# EAGLE design Proyecto (EAGLE 9.1.3)
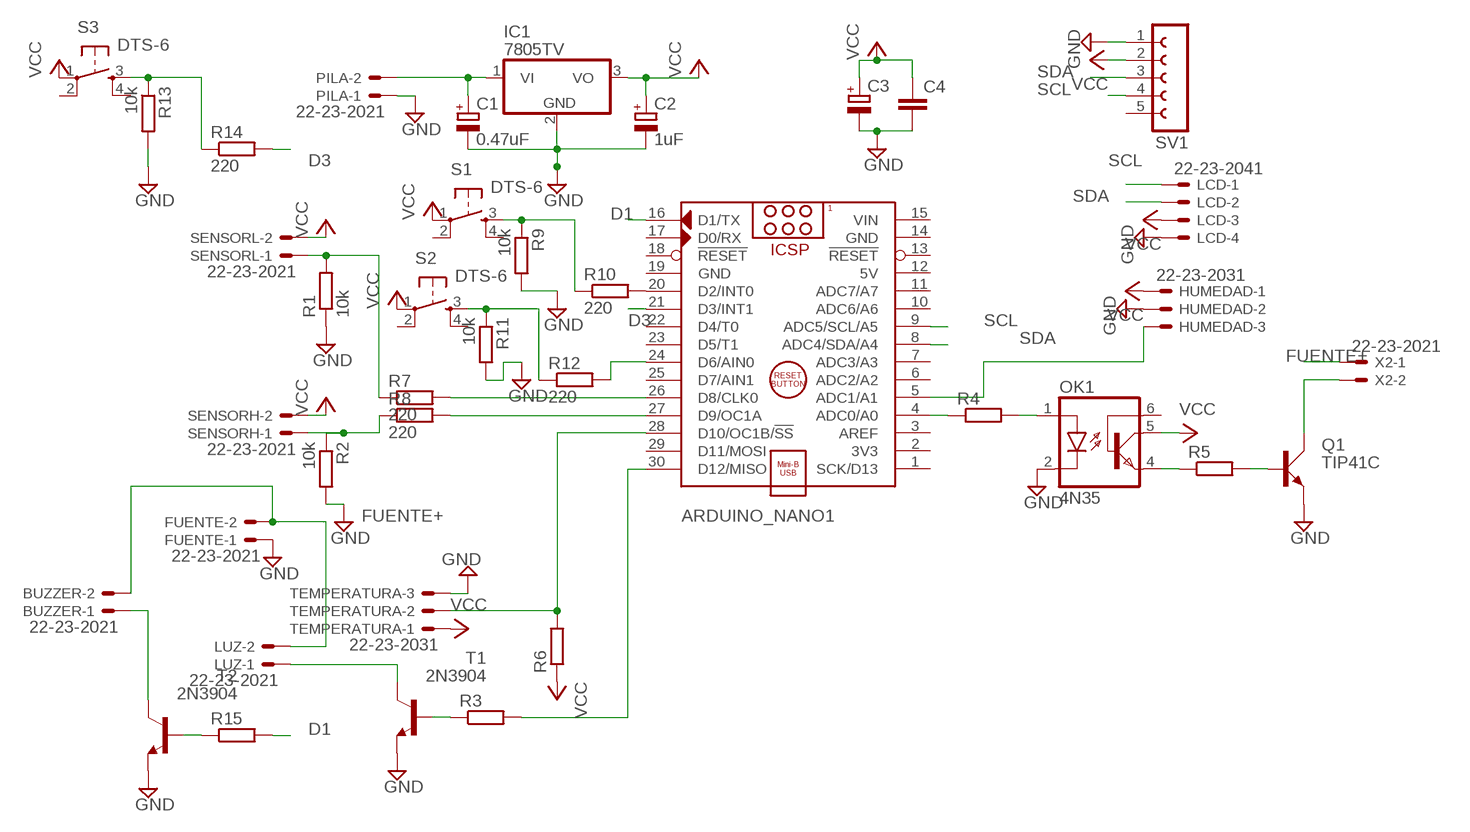
[diagram p0: schematic, sheet 1]

## Parts
ARDUINO_NANO1  ARDUINO_NANO  [ARDUINO_NANO]
BUZZER  22-23-2021  [22-23-2021]
C1  0.47uF  CPOL-EUE1.8-4  [E1,8-4]
C2  1uF  CPOL-EUE1.8-4  [E1,8-4]
C3  CPOL-EUE3.5-10  [E3,5-10]
C4  C-EU025-040X050  [C025-040X050]
FUENTE  22-23-2021  [22-23-2021]
HUMEDAD  22-23-2031  [22-23-2031]
IC1  7805TV  [TO220V]
LCD  22-23-2041  [22-23-2041]
LUZ  22-23-2021  [22-23-2021]
OK1  4N35  [DIL06]
PILA  22-23-2021  [22-23-2021]
Q1  TIP41C  [TO220AV]
R1  10k  R-EU_0207/10  [0207/10]
R2  10k  R-EU_0207/10  [0207/10]
R3  R-EU_0207/10  [0207/10]
R4  R-EU_0207/10  [0207/10]
R5  R-EU_0207/10  [0207/10]
R6  R-EU_0207/10  [0207/10]
R7  220  R-EU_0207/10  [0207/10]
R8  220  R-EU_0207/10  [0207/10]
R9  10k  R-EU_0207/10  [0207/10]
R10  220  R-EU_0207/10  [0207/10]
R11  10k  R-EU_0207/10  [0207/10]
R12  220  R-EU_0207/10  [0207/10]
R13  10k  R-EU_0207/10  [0207/10]
R14  220  R-EU_0207/10  [0207/10]
R15  R-EU_0207/10  [0207/10]
S1  DTS-6  [DTS-6]
S2  DTS-6  [DTS-6]
S3  DTS-6  [DTS-6]
SENSORH  22-23-2021  [22-23-2021]
SENSORL  22-23-2021  [22-23-2021]
SV1  FE05-1  [FE05-1]
T1  2N3904  [TO92]
T2  2N3904  [TO92]
TEMPERATURA  22-23-2031  [22-23-2031]
X2  22-23-2021  [22-23-2021]

## Nets
D1: ARDUINO_NANO1.16(D1/TX) R15.2
D3: ARDUINO_NANO1.21(D3/INT1) R14.2
FUENTE+: BUZZER.2 FUENTE.2 LUZ.2 X2.1
GND: C1.- C2.- C3.- C4.2 FUENTE.1 HUMEDAD.2 IC1.2(GND) LCD.4 OK1.2(C) PILA.1 Q1.E R1.1 R2.2 R9.2 R11.2 R13.2 SV1.1 T1.3(E) T2.3(E) TEMPERATURA.3
N$1: ARDUINO_NANO1.28(D10/OC1B/!SS) R6.2 TEMPERATURA.2
N$2: R1.2 R7.1 SENSORL.1
N$3: R2.1 R8.1 SENSORH.1
N$4: LUZ.1 T1.1(C)
N$5: R3.1 T1.2(B)
N$6: ARDUINO_NANO1.30(D12/MISO) R3.2
N$7: Q1.B R5.2
N$8: OK1.4(EMI) R5.1
N$9: Q1.C X2.2
N$10: OK1.1(A) R4.2
N$11: ARDUINO_NANO1.4(ADC0/A0) R4.1
N$12: ARDUINO_NANO1.27(D9/OC1A) R8.2
N$13: ARDUINO_NANO1.26(D8/CLK0) R7.2
N$14: C1.+ IC1.1(VI) PILA.2
N$15: ARDUINO_NANO1.5(ADC1/A1) HUMEDAD.3
N$16: R9.1 R10.1 S1.3
N$17: ARDUINO_NANO1.20(D2/INT0) R10.2
N$18: R11.1 R12.1 S2.3
N$19: ARDUINO_NANO1.24(D6/AIN0) R12.2
N$20: R13.1 R14.1 S3.3
N$21: BUZZER.1 T2.1(C)
N$22: R15.1 T2.2(B)
SCL: ARDUINO_NANO1.9(ADC5/SCL/A5) LCD.1 SV1.4
SDA: ARDUINO_NANO1.8(ADC4/SDA/A4) LCD.2 SV1.3
VCC: C2.+ C3.+ C4.1 HUMEDAD.1 IC1.3(VO) LCD.3 OK1.5(COL) R6.1 S1.1 S2.1 S3.1 SENSORH.2 SENSORL.2 SV1.2 TEMPERATURA.1
Unconnected: ARDUINO_NANO1.1(SCK/D13) ARDUINO_NANO1.2(3V3) ARDUINO_NANO1.3(AREF) ARDUINO_NANO1.6(ADC2/A2) ARDUINO_NANO1.7(ADC3/A3) ARDUINO_NANO1.10(ADC6/A6) ARDUINO_NANO1.11(ADC7/A7) ARDUINO_NANO1.13(!RESET) ARDUINO_NANO1.17(D0/RX) ARDUINO_NANO1.18(!RESET) ARDUINO_NANO1.22(D4/T0) ARDUINO_NANO1.23(D5/T1) ARDUINO_NANO1.25(D7/AIN1) ARDUINO_NANO1.29(D11/MOSI) OK1.6(BAS) S1.2 S1.4 S2.2 S2.4 S3.2 S3.4 SV1.5

## Power pins joined to a net without a drawn wire
5V: ARDUINO_NANO1.12(5V)
GND: ARDUINO_NANO1.14(GND) ARDUINO_NANO1.19(GND)
VIN: ARDUINO_NANO1.15(VIN)

## Library data of the parts
ARDUINO_NANO1 = ArduinoNanoV30:ARDUINO_NANO: Arduino Nano V3.0 Module Overview: The Arduino Nano is a small, complete, and breadboard-friendly board based on the ATmega328 (Arduino Nano 3.x) or ATmega168 (Arduino Nano 2.x). It has more or less the same functionality of the Arduino Duemilanove, but in a different package. It lacks only a DC power jack, and works with a Mini-B USB cable instead of a standard one. The Nano was designed and is being produced by Gravitech <http://www.gravitech.us/arna30wiatp.html>. General specifications: Item Value Microcontroller Atmel ATmega168 or ATmega328 Operating Voltage (logic level) 5 V Input Voltage (recommended) 7-12 V Input Voltage (limits) 6-20 V Digital I/O Pins 14 (of which 6 provide PWM output) Analog Input Pins 8 DC Current per I/O Pin 40 mA Flash Memory 16 KB (ATmega168) or 32 KB (ATmega328) of which 2 KB used by bootloader SRAM 1 KB (ATmega168) or 2 KB (ATmega328) EEPROM 512 bytes (ATmega168) or 1 KB (ATmega328) Clock Speed 16 MHz Dimensions (Inches) 0.73" x 1.70" Dimensions (mm) 18mm x 45mm Overall height About 9 mm (not including pins) Weigth 5 g Power: The Arduino Nano can be powered via the Mini-B USB connection, 6-20V unregulated external power supply (pin 30), or 5V regulated external power supply (pin 27). The power source is automatically selected to the highest voltage source. Memory: The ATmega168 has 16 KB of flash memory for storing code (of which 2 KB is used for the bootloader); the ATmega328 has 32 KB, (also with 2 KB used for the bootloader). The ATmega168 has 1 KB of SRAM and 512 bytes of EEPROM (which can be read and written with the EEPROM library); the ATmega328 has 2 KB of SRAM and 1 KB of EEPROM. Input and Output: Each of the 14 digital pins on the Nano can be used as an input or output, using pinMode(), digitalWrite(), and digitalRead() functions. They operate at 5 volts. Each pin can provide or receive a maximum of 40 mA and has an internal pull-up resistor (disconnected by default) of 20-50 kOhms. In addition, some pins have specialized functions. Visit Arduino - ArduinoBoardNano <https://www.arduino.cc/en/Main/ArduinoBoardNano>
BUZZER FUENTE LUZ PILA SENSORH SENSORL X2 = con-molex:22-23-2021: .100" (2.54mm) Center Header - 2 Pin; MF: MOLEX; MPN: 22-23-2021; OC_FARNELL: 1462926; OC_NEWARK: 25C3832
C1-C3 = rcl:CPOL-EU: POLARIZED CAPACITOR, European symbol; SPICEPREFIX: C
C4 = rcl:C-EU: CAPACITOR, European symbol; SPICEPREFIX: C
HUMEDAD TEMPERATURA = con-molex:22-23-2031: .100" (2.54mm) Center Header - 3 Pin; MF: MOLEX; MPN: 22-23-2031; OC_FARNELL: 1462950; OC_NEWARK: 30C0862
IC1 = linear:78*: Positive VOLTAGE REGULATOR Source: http://cache.national.com/ds/LM/LM78L05.pdf http://www.fairchildsemi.com/ds/LM/LM7805.pdf
LCD = con-molex:22-23-2041: .100" (2.54mm) Center Header - 4 Pin; MF: MOLEX; MPN: 22-23-2041; OC_FARNELL: 1462920; OC_NEWARK: 38C0355
OK1 = optocoupler:4N35: MOTOROLA OPTO COUPLER; MF: FAIRCHILD SEMICONDUCTOR; MPN: 4N35; OC_FARNELL: 1328375; OC_NEWARK: 72K9946
Q1 = transistor-power:TIP41C: NPN TRANSISTOR
R1-R15 = rcl:R-EU_: RESISTOR, European symbol; SPICEPREFIX: R
S1-S3 = switch-tact:DTS-6
SV1 = con-lsta:FE05-1: FEMALE HEADER; OC_FARNELL: unknown; OC_NEWARK: unknown
T1 T2 = transistor:2N3904: NPN TRANSISTOR

## Board
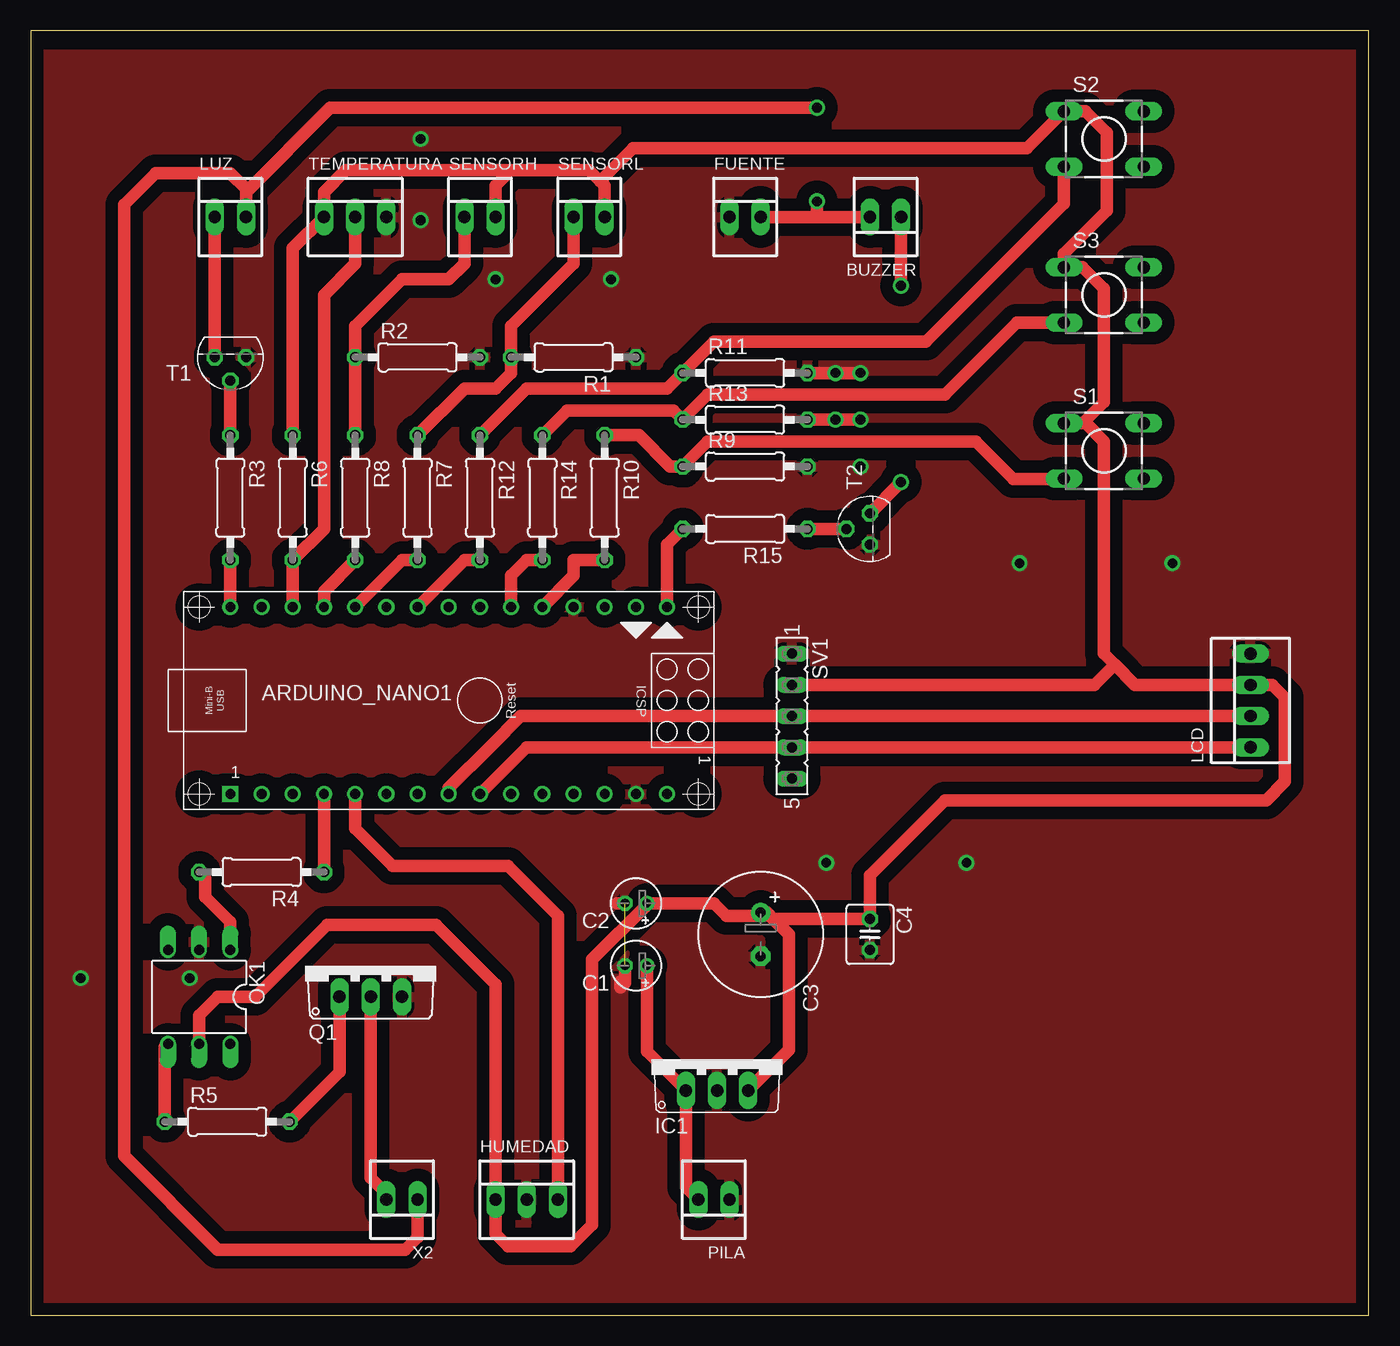
[diagram p1: board, top side]
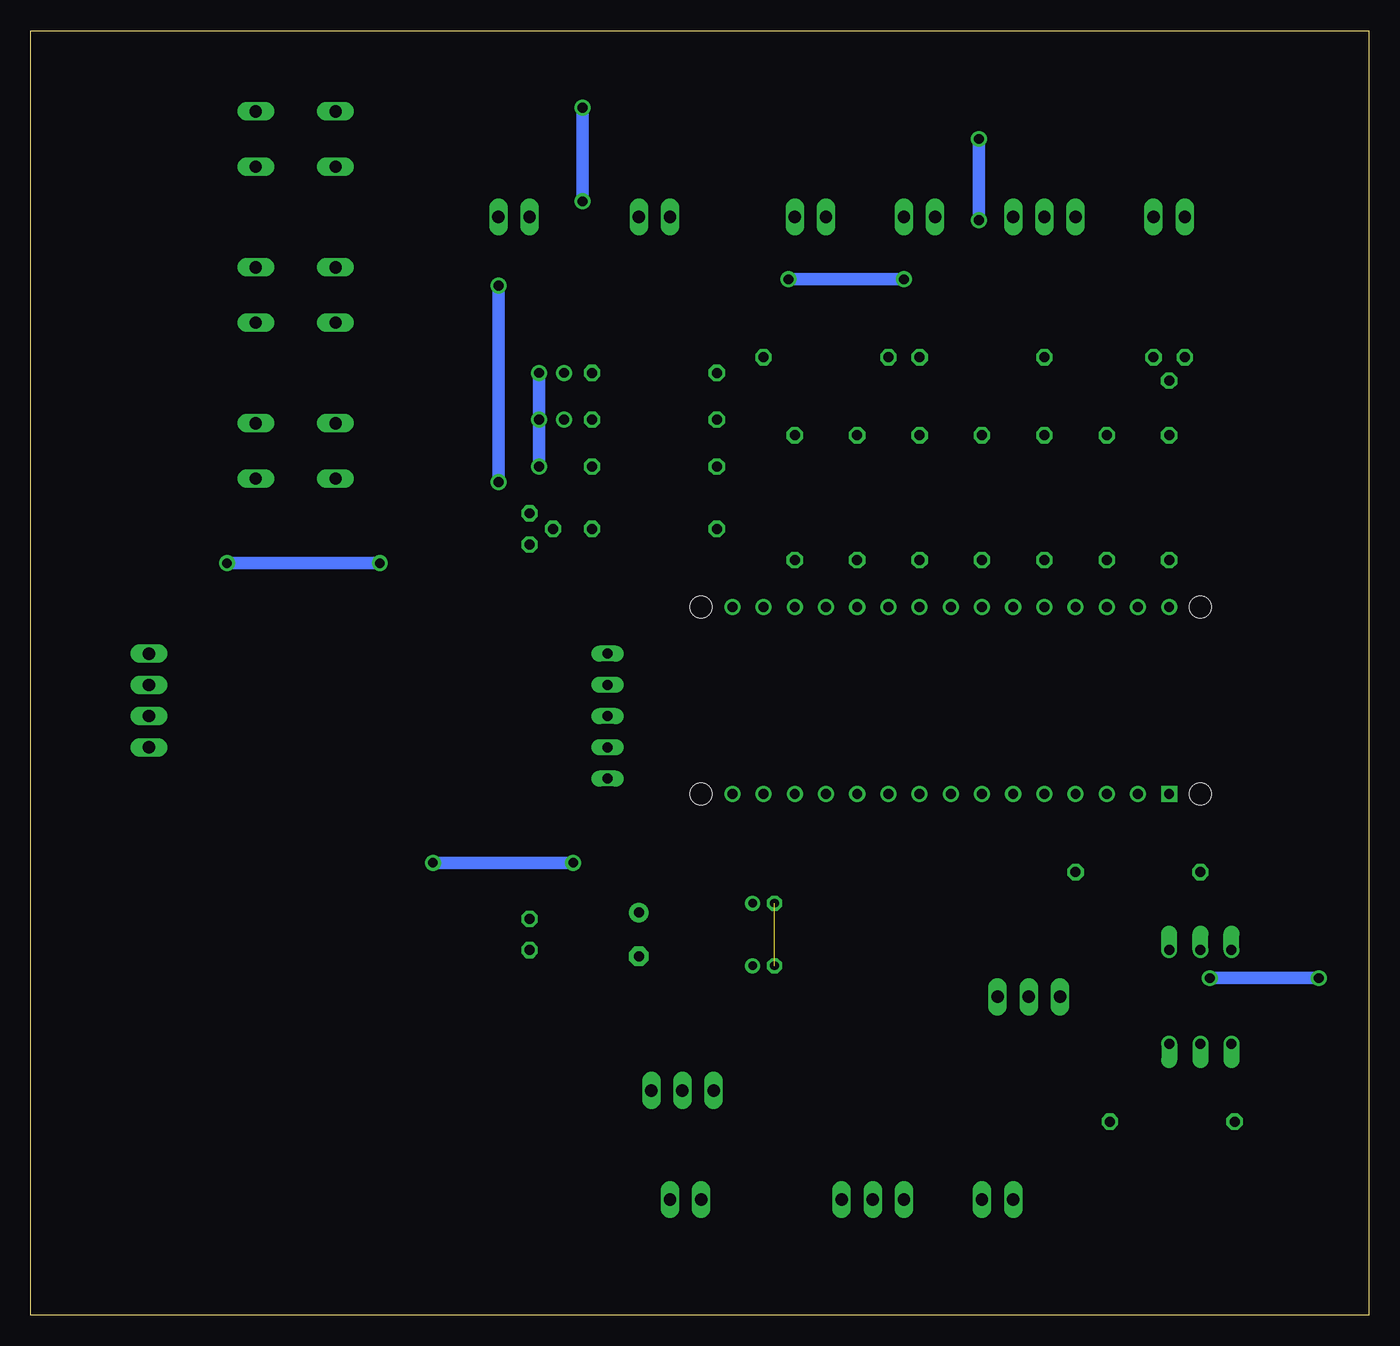
[diagram p2: board, bottom side, seen from below]

Size 108.95 x 104.57 mm. Coordinates in mm from the lower left corner, seen from the top.
Outline: 0,0 108.95,0 108.95,104.57 0,104.57 0,0
Copper layers (1*16): Top 0.035mm / dielectric 1.5mm / Bottom 0.035mm
Design rules "default": minimum track width 6mil, minimum drill 0.35mm, track to track 6mil, track to pad 6mil, pad to pad 6mil, via to via 6mil, smd to smd 6mil, copper to edge 40mil, drill to drill 6mil, minimum pad ring 10mil, minimum via ring 8mil, stop-mask expansion 4mil, vias tented up to drill 0mil, thermal gap 10mil

### Footprints (pad centres in the part's own frame; a part is rotated, then mirrored left to right if it is on the bottom)
ARDUINO_NANO = drill 0.8 square: 1 -20.32,-7.62 | drill 0.8: 2 -17.78,-7.62; 3 -15.24,-7.62; 4 -12.7,-7.62; 5 -10.16,-7.62; 6 -7.62,-7.62; 7 -5.08,-7.62; 8 -2.54,-7.62; 9 0,-7.62; 10 2.54,-7.62; 11 5.08,-7.62; 12 7.62,-7.62; 13 10.16,-7.62; 14 12.7,-7.62; 15 15.24,-7.62; 16 15.24,7.62; 17 12.7,7.62; 18 10.16,7.62; 19 7.62,7.62; 20 5.08,7.62; 21 2.54,7.62; 22 0,7.62; 23 -2.54,7.62; 24 -5.08,7.62; 25 -7.62,7.62; 26 -10.16,7.62; 27 -12.7,7.62; 28 -15.24,7.62; 29 -17.78,7.62; 30 -20.32,7.62 | hole 1.778: -22.86,-7.62; -22.86,7.62; 17.78,7.62; 17.78,-7.62
22-23-2021 = drill 1 long: 1 -1.27,0; 2 1.27,0
E1,8-4 = drill 0.711 pad 1.168: + -0.889,0 | drill 0.711 pad 1.168 octagon: - 0.889,0
E3,5-10 = drill 0.813 pad 1.6: + -1.778,0 | drill 0.813 pad 1.6 octagon: - 1.778,0
C025-040X050 = drill 0.813 octagon: 1 -1.27,0; 2 1.27,0
22-23-2031 = drill 1 long: 1 -2.54,0; 2 0,0; 3 2.54,0
TO220V = drill 1.016 long: 1 -2.54,-2.54; 2 0,-2.54; 3 2.54,-2.54
22-23-2041 = drill 1 long: 1 -3.81,0; 2 -1.27,0; 3 1.27,0; 4 3.81,0
DIL06 = drill 0.813 offset: 1 -2.54,-3.81; 2 0,-3.81; 3 2.54,-3.81; 4 2.54,3.81; 5 0,3.81; 6 -2.54,3.81
TO220AV = drill 1.016 long: B -2.54,-2.54; C 0,-2.54; E 2.54,-2.54
0207/10 = drill 0.813 octagon: 1 -5.08,0; 2 5.08,0
DTS-6 = drill 1 long: 1 -3.25,2.25; 2 3.25,2.25; 3 -3.25,-2.25; 4 3.25,-2.25
FE05-1 = drill 0.813 long: 1 -5.08,0; 2 -2.54,0; 3 0,0; 4 2.54,0; 5 5.08,0
TO92 = drill 0.813 octagon: 1 1.27,0; 2 0,1.905; 3 -1.27,0

### Placement (x,y rotation side)
ARDUINO_NANO1  36.58,50.04 0 top
BUZZER  69.6,89.41 180 top
C1  49.28,28.45 180 top
C2  49.28,33.53 180 top
C3  59.44,30.99 270 top
C4  68.33,30.99 270 top
FUENTE  58.17,89.41 0 top
HUMEDAD  40.39,9.4 0 top
IC1  55.88,20.83 0 top
LCD  99.31,50.04 90 top
LUZ  16.26,89.41 0 top
OK1  13.72,25.91 180 top
PILA  55.63,9.4 180 top
Q1  27.69,28.45 0 top
R1  44.2,77.98 180 top
R2  31.5,77.98 0 top
R3  16.26,66.55 270 top
R4  18.8,36.07 180 top
R5  16,15.75 0 top
R6  21.34,66.55 270 top
R7  31.5,66.55 270 top
R8  26.42,66.55 270 top
R9  58.17,69.09 0 top
R10  46.74,66.55 270 top
R11  58.17,76.71 0 top
R12  36.58,66.55 270 top
R13  58.17,72.9 0 top
R14  41.66,66.55 270 top
R15  58.17,64.01 180 top
S1  87.38,70.36 0 top
S2  87.38,95.76 0 top
S3  87.38,83.06 0 top
SENSORH  36.58,89.41 0 top
SENSORL  45.47,89.41 0 top
SV1  61.98,48.77 270 top
T1  16.26,77.98 180 top
T2  68.33,64.01 90 top
TEMPERATURA  26.42,89.41 0 top
X2  30.23,9.4 180 top

### Tracks (layer width: path | path; a pad name or v marks a point on that pad's centre or on a via)
D1
  Top 1.016: ARDUINO_NANO1.16 51.82,62.74 R15.2
D3
  Top 1.016: ARDUINO_NANO1.21 39.12,60.2 40.39,61.47 R14.2
FUENTE+  (via drill 0.8 pad 1.3)
  Top 1.016: FUENTE.2 64.01,89.41 | 64.01,89.41 BUZZER.2 | X2.1 31.5,6.35 30.48,5.33 15.24,5.33 7.62,12.95 7.62,90.42 10.16,92.96 16.26,92.96 17.53,91.69 LUZ.2 17.53,91.44 24.38,98.3 v64.01,98.3 | 64.01,89.41 v64.01,90.68
  Bottom 1.016: v64.01,90.68 v64.01,98.3
GND  (via drill 0.8 pad 1.3)  (1 unrouted)
  Top 1.016: 48.01,26.67 48.01,27.18 48.01,26.67 | C1.- 48.39,27.05 48.01,26.67 | R11.2 v65.53,76.71 v67.56,76.71 | R13.2 v65.53,72.9 v67.56,72.9 | C2.- 47.75,33.53 C2.-
  Bottom 1.016: v64.77,36.83 v76.2,36.83 | v80.52,61.21 v92.96,61.21 | v12.95,27.43 v4.06,27.43 | v37.85,84.33 v47.24,84.33 | v31.75,89.15 v31.75,95.76 | v67.56,69.09 v67.56,72.9 v67.56,76.71
  pour Top (isolate 1.016): 0.51,102.62 0.51,1.02 107.7,1.02 107.7,102.36 107.95,102.62
N$1
  Top 1.016: ARDUINO_NANO1.28 R6.2 23.88,64.01 23.88,83.06 26.42,85.6 TEMPERATURA.2
N$2
  Top 1.016: R7.1 35.31,75.44 37.85,75.44 39.12,76.71 R1.2 39.12,80.52 44.2,85.6 SENSORL.1
N$3
  Top 1.016: R8.1 R2.1 26.42,80.52 30.23,84.33 34.04,84.33 35.31,85.6 SENSORH.1
N$4
  Top 1.016: T1.1 LUZ.1
N$5
  Top 1.016: R3.1 T1.2
N$6
  Top 1.016: ARDUINO_NANO1.30 R3.2
N$7
  Top 1.016: R5.2 25.15,19.81 Q1.B
N$8
  Top 1.016: R5.1 10.92,21.84 OK1.4
N$9
  Top 1.016: X2.2 28.96,9.91 27.69,11.18 Q1.C
N$10
  Top 1.016: OK1.1 16.26,32 14.22,34.04 14.22,35.56 R4.2
N$11
  Top 1.016: ARDUINO_NANO1.4 R4.1
N$12
  Top 1.016: ARDUINO_NANO1.27 23.88,58.93 R8.2
N$13
  Top 1.016: ARDUINO_NANO1.26 30.23,61.47 R7.2
N$14
  Top 1.016: PILA.2 53.34,10.41 IC1.1 50.16,21.46 C1.+
N$15
  Top 1.016: HUMEDAD.3 42.93,32.51 38.86,36.58 29.46,36.58 26.42,39.62 ARDUINO_NANO1.5
N$16
  Top 1.016: R10.1 49.53,71.63 52.07,69.09 R9.1 55.12,71.12 76.96,71.12 80.01,68.07 84.09,68.07 S1.3
N$17
  Top 1.016: ARDUINO_NANO1.20 44.2,60.2 44.2,61.47 R10.2
N$18
  Top 1.016: R12.1 40.39,75.44 51.82,75.44 R11.1 55.63,79.25 72.9,79.25 84.13,90.48 S2.3
N$19
  Top 1.016: ARDUINO_NANO1.24 35.31,61.47 R12.2
N$20
  Top 1.016: R14.1 43.69,73.66 52.32,73.66 R13.1 55.12,74.93 74.42,74.93 80.3,80.81 S3.3
N$21  (via drill 0.8 pad 1.3)
  Top 1.016: BUZZER.1 v70.87,83.82 | v70.87,67.82 T2.1
  Bottom 1.016: v70.87,83.82 v70.87,67.82
N$22
  Top 1.016: R15.1 T2.2
SCL
  Top 1.016: LCD.1 SV1.4 40.39,46.23 ARDUINO_NANO1.9
SDA
  Top 1.016: LCD.2 SV1.3 39.88,48.77 37.47,46.36 34.04,42.93 ARDUINO_NANO1.8
VCC
  Top 1.016: R6.1 21.34,86.87 TEMPERATURA.1 23.88,91.44 25.65,93.22 39.12,93.22 | SENSORH.2 37.85,91.95 39.12,93.22 | 39.12,93.22 45.47,93.22 46.36,92.33 | 46.36,92.33 46.74,91.95 SENSORL.2 | 46.36,92.33 49.02,95 81.11,95 S2.1 85.89,98.01 87.63,96.27 87.63,89.92 84.13,86.41 S3.1 85.63,85.31 87.38,83.57 87.38,74.33 85.65,72.61 S1.1 85.9,72.61 87.38,71.14 87.38,53.85 88.27,52.96 | IC1.3 61.72,21.59 61.72,30.99 60.45,32.26 | 59.94,32.77 C3.+ | 60.45,32.26 59.94,32.77 | 60.45,32.26 C4.1 68.33,35.81 74.42,41.91 100.58,41.91 102.11,43.43 102.11,50.29 101.09,51.31 LCD.3 89.92,51.31 88.27,52.96 | 59.94,32.77 59.69,32.51 56.64,32.51 55.63,33.53 C2.+ 50.16,33.4 45.72,28.96 45.72,7.37 43.94,5.59 38.86,5.59 37.85,6.6 HUMEDAD.1 37.85,26.92 33.02,31.75 24.13,31.75 18.29,25.91 15.24,25.91 13.72,24.38 OK1.5 | SV1.2 86.61,51.31 88.27,52.96